# EAGLE design power_supply_board (EAGLE 9.4.2)
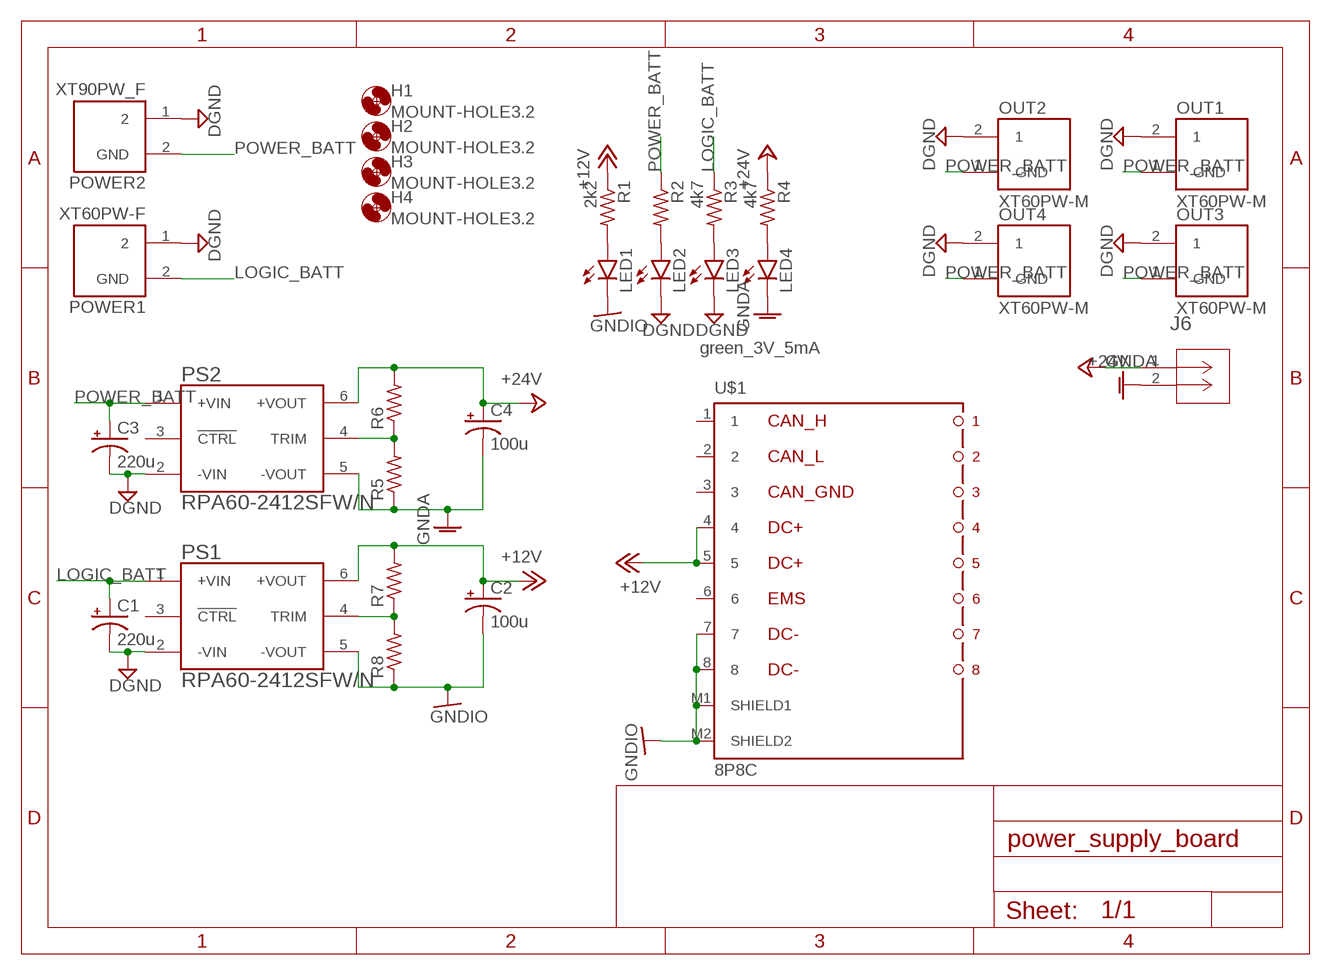
[diagram p0: schematic, sheet 1]

## Parts
C1  220u  CPOL-USE2.5-5  [E2,5-5]
C2  100u  CPOL-USE2-5  [E2-5]
C3  220u  CPOL-USE2.5-5  [E2,5-5]
C4  100u  CPOL-USE2-5  [E2-5]
H1  MOUNT-HOLE3.2  [3,2]
H2  MOUNT-HOLE3.2  [3,2]
H3  MOUNT-HOLE3.2  [3,2]
H4  MOUNT-HOLE3.2  [3,2]
J6  1744426-2  [CONN2_1744426-2]
LED1  LEDSML0603  [SML0603]
LED2  LEDSML0603  [SML0603]
LED3  green_3V_5mA  LEDSML0603  [SML0603]
LED4  LEDSML0603  [SML0603]
OUT1  XT60PW-M  [AMASS_XT60PW_M]
OUT2  XT60PW-M  [AMASS_XT60PW_M]
OUT3  XT60PW-M  [AMASS_XT60PW_M]
OUT4  XT60PW-M  [AMASS_XT60PW_M]
POWER1  XT60PW-F  [AMASS_XT60PW-F]
POWER2  XT90PW_F  [AMASS_XT90PW_F]
PS1  RPA60-2412SFW/N  [CONV_RPA60-2412SFW/N]
PS2  RPA60-2412SFW/N  [CONV_RPA60-2412SFW/N]
R1  2k2  R-US_R0603  [R0603]
R2  R-US_R0603  [R0603]
R3  4k7  R-US_R0603  [R0603]
R4  4k7  R-US_R0603  [R0603]
R5  R-US_R0603  [R0603]
R6  R-US_R0603  [R0603]
R7  R-US_R0603  [R0603]
R8  R-US_R0603  [R0603]
U$1  8P8C  [8P8C]

## Nets
+12V: C2.+ PS1.6(+VOUT) R1.1 R7.2 U$1.4 U$1.5
+24V: C4.+ J6.1 PS2.6(+VOUT) R4.1 R6.2
DGND: C1.- C3.- LED2.C LED3.C OUT1.2 OUT2.2 OUT3.2 OUT4.2 POWER1.1 POWER2.1 PS1.2(-VIN) PS2.2(-VIN)
GNDA: C4.- J6.2 LED4.C PS2.5(-VOUT) R5.1
GNDIO: C2.- LED1.C PS1.5(-VOUT) R8.1 U$1.7 U$1.8 U$1.M1(SHIELD1) U$1.M2(SHIELD2)
LOGIC_BATT: C1.+ POWER1.2(GND) PS1.1(+VIN) R3.1
N$1: LED1.A R1.2
N$2: LED2.A R2.2
N$3: LED3.A R3.2
N$4: LED4.A R4.2
N$5: PS2.4(TRIM) R5.2 R6.1
N$6: PS1.4(TRIM) R7.1 R8.2
POWER_BATT: C3.+ OUT1.1(GND) OUT2.1(GND) OUT3.1(GND) OUT4.1(GND) POWER2.2(GND) PS2.1(+VIN) R2.1
Unconnected: PS1.3(!CTRL) PS2.3(!CTRL) U$1.1 U$1.2 U$1.3 U$1.6

## Library data of the parts
C1-C4 = rcl:CPOL-US: POLARIZED CAPACITOR, American symbol; SPICEPREFIX: C
H1-H4 = holes:MOUNT-HOLE: MOUNTING HOLE with drill center marker
J6 = EP2.5:1744426-2; MANUFACTURER_PART_NUMBER: 17444262; VENDOR: TE Connectivity
LED1-LED4 = led:LED: LED OSRAM: - CHIPLED LG R971, LG N971, LY N971, LG Q971, LY Q971, LO R971, LY R971 LH N974, LH R974 LS Q976, LO Q976, LY Q976 LO Q996 - Hyper CHIPLED LW Q18S LB Q993, LB Q99A, LB R99A - SideLED LS A670, LO A670, LY A670, LG A670, LP A670 LB A673, LV A673, LT A673, LW A673 LH A674 LY A675 LS A676, LA A676, LO A676, LY A676, LW A676 LS A679, LY A679, LG A679 - Hyper Micro SIDELED® LS Y876, LA Y876, LO Y876, LY Y876 LT Y87S - SmartLED LW L88C, LW L88S LB L89C, LB L89S, LG L890 LS L89K, LO L89K, LY L89K LS L896, LA L896, LO L896, LY L896 - TOPLED LS T670, LO T670, LY T670, LG T670, LP T670 LSG T670, LSP T670, LSY T670, LOP T670, LYG T670 LG T671, LOG T671, LSG T671 LB T673, LV T673, LT T673, LW T673 LH T674 LS T676, LA T676, LO T676, LY T676, LB T676, LH T676, LSB T676, LW T676 LB T67C, LV T67C, LT T67C, LS T67K, LO T67K, LY T67K, LW E67C LS E67B, LA E67B, LO E67B, LY E67B, LB E67C, LV E67C, LT E67C LW T67C LS T679, LY T679, LG T679 LS T770, LO T770, LY T770, LG T770, LP T770 LB T773, LV T773, LT T773, LW T773 LH T774 LS E675, LA E675, LY E675, LS T675 LS T776, LA T776, LO T776, LY T776, LB T776 LHGB T686 LT T68C, LB T68C - Hyper Mini TOPLED® LB M676 - Mini TOPLED Santana® LG M470 LS M47K, LO M47K, LY M47K Source: http://www.osram.convergy.de LUXEON: - LUMILED® LXK2-PW12-R00, LXK2-PW12-S00, LXK2-PW14-U00, LXK2-PW14-V00 LXK2-PM12-R00, LXK2-PM12-S00, LXK2-PM14-U00 LXK2-PE12-Q00, LXK2-PE12-R00, LXK2-PE12-S00, LXK2-PE14-T00, LXK2-PE14-U00 LXK2-PB12-K00, LXK2-PB12-L00, LXK2-PB12-M00, LXK2-PB14-N00, LXK2-PB14-P00, LXK2-PB14-Q00 LXK2-PR12-L00, LXK2-PR12-M00, LXK2-PR14-Q00, LXK2-PR14-R00 LXK2-PD12-Q00, LXK2-PD12-R00, LXK2-PD12-S00 LXK2-PH12-R00, LXK2-PH12-S00 LXK2-PL12-P00, LXK2-PL12-Q00, LXK2-PL12-R00 Source: www.luxeon.com KINGBRIGHT: KA-3528ASYC Source: www.kingbright.com
OUT1-OUT4 = XT60_Connecotr:XT60PW-M
POWER1 = XT60_Connecotr:XT60PW-F; AVAILABILITY: Unavailable; MF: AMASS; MP: XT60PW-M; PACKAGE: Package Analog Devices; PRICE: None
POWER2 = XT60_Connecotr:XT90PW_F
PS1 PS2 = RPA60-2412SFW_N:RPA60-2412SFW/N: 60 Watt 2“x1“ Single Output; AVAILABILITY: Unavailable; DESCRIPTION: CONV DC/DC 60W 9-36VIN 12VOUT THT 2x1; MF: Recom Power; MP: RPA60-2412SFW/N; PACKAGE: DIP-6 Recom Power; PRICE: None
R1-R8 = rcl:R-US_: RESISTOR, American symbol; SPICEPREFIX: R
U$1 = con-rj45:8P8C

## Board
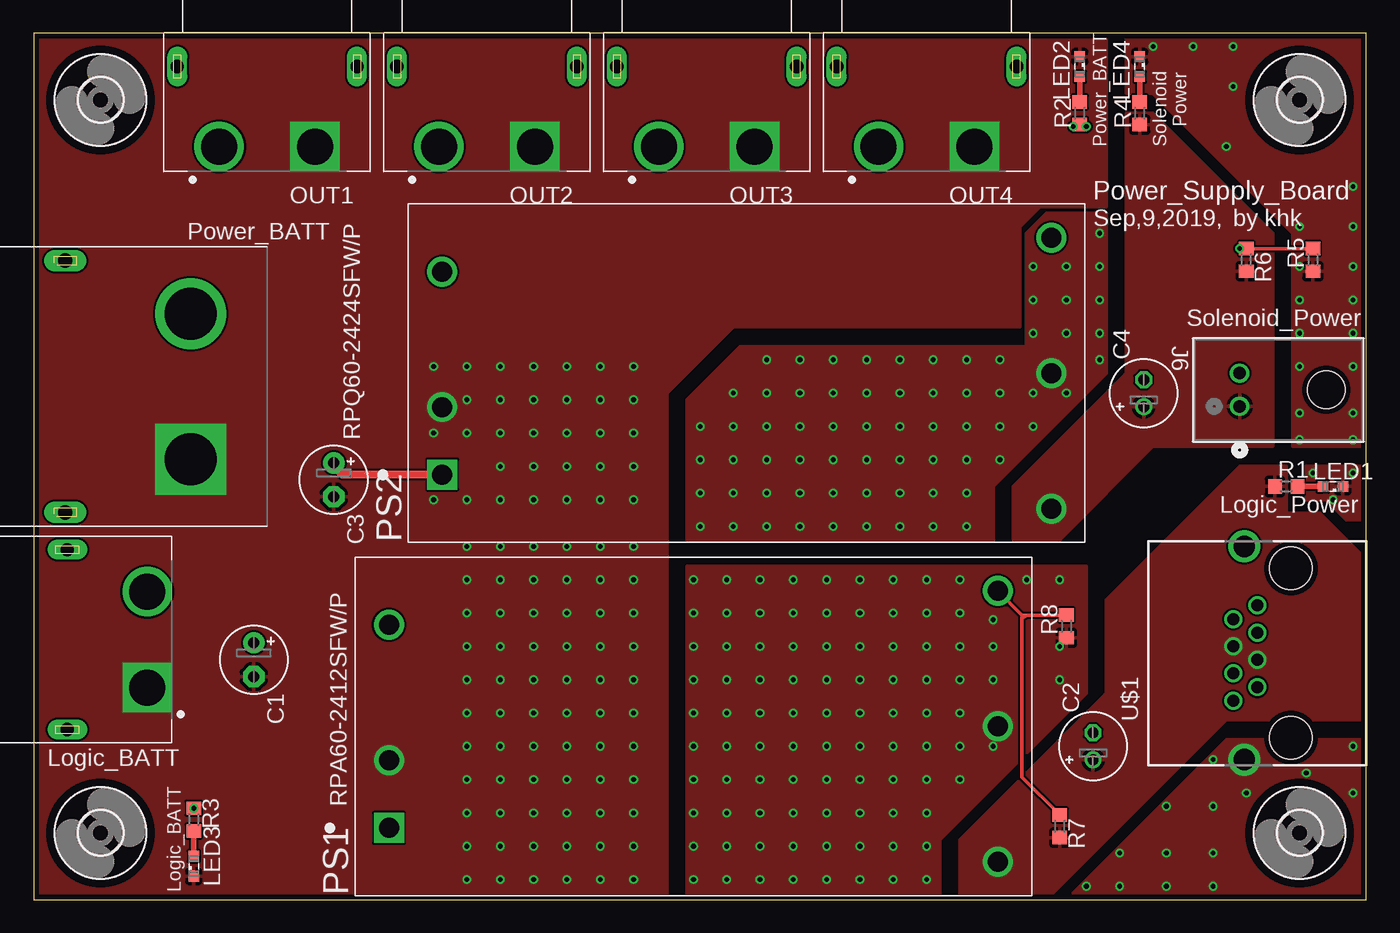
[diagram p1: board, top side]
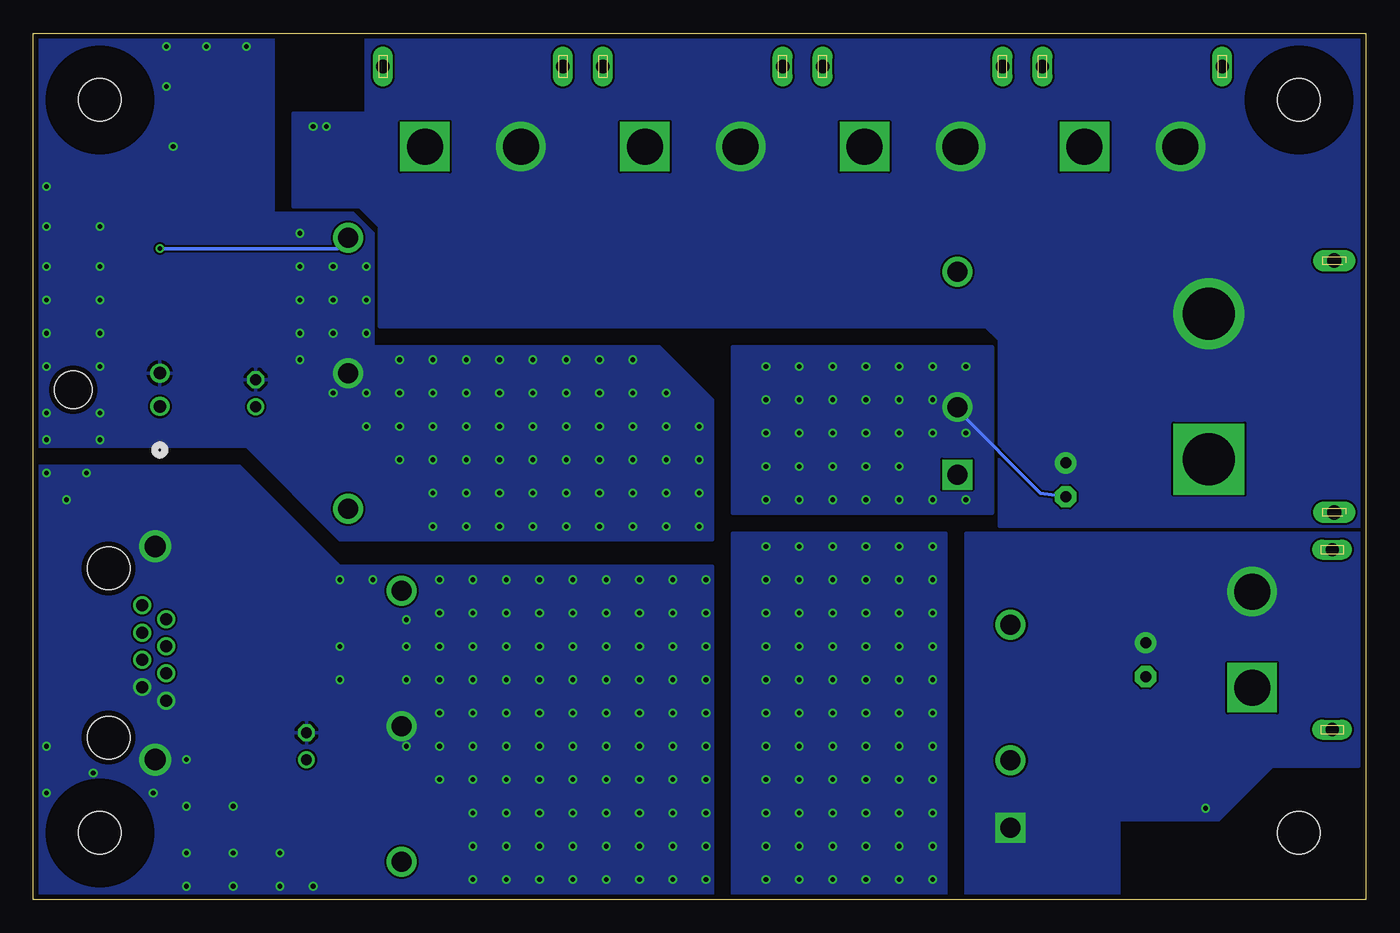
[diagram p2: board, bottom side, seen from below]

Size 100 x 65 mm. Coordinates in mm from the lower left corner, seen from the top.
Outline: 0,0 100,0 100,65 0,65 0,0
Copper layers (1*16): Top 0.035mm / dielectric 1.5mm / Bottom 0.035mm
Design rules "seeed_2layers": minimum track width 6mil, minimum drill 0.2mm, track to track 6mil, track to pad 6mil, pad to pad 6mil, via to via 6mil, smd to smd 0mil, copper to edge 0.4mm, drill to drill 12mil, minimum pad ring 0.15mm, minimum via ring 0.15mm, stop-mask expansion 4mil, vias tented up to drill 50mil, thermal gap 10mil

### Footprints (pad centres in the part's own frame; a part is rotated, then mirrored left to right if it is on the bottom)
E2,5-5 = drill 0.813 pad 1.6: + -1.27,0 | drill 0.813 pad 1.6 octagon: - 1.27,0
E2-5 = drill 0.813 pad 1.27: + -1.016,0 | drill 0.813 pad 1.27 octagon: - 1.016,0
3,2 = hole 3.2: 0,0
CONN2_1744426-2 = drill 0.94 pad 1.448: 1 2.489,0; 2 0,0 | hole 2.794: 1.245,6.502
SML0603 = smd 0.8 x 0.8: A 0.75,0; C -0.75,0
AMASS_XT60PW_M = drill 2.7: 1 -3.6,-6 | drill 2.7 square: 2 3.6,-6 | drill 1 pad 1.2 long: S1 -6.75,0; S2 6.75,0
AMASS_XT60PW-F = drill 2.7 square: 1 -3.6,-6 | drill 2.7: 2 3.6,-6 | drill 1 pad 1.2 long: S1 -6.75,0; S2 6.75,0
AMASS_XT90PW_F = drill 3.9 pad 5.334 square: 1 -5.45,-2.25 | drill 3.9 pad 5.334: 2 5.45,-2.25 | drill 1.067 pad 1.27 long: S1 -9.45,7.15 | drill 1.067 pad 1.2 long: S2 9.45,7.15
CONV_RPA60-2412SFW/N = drill 1.5 square: 1 -22.86,-7.62 | drill 1.5: 2 -22.86,-2.54; 3 -22.86,7.62; 4 22.86,10.16; 5 22.86,0; 6 22.86,-10.16
R0603 = smd 1 x 1.1: 1 -0.85,0; 2 0.85,0
8P8C = drill 0.9 pad 1.3: 1 3.57,-3.81; 2 2.55,-2.03; 3 1.53,-3.81; 4 0.51,-2.03; 5 -0.51,-3.81; 6 -1.53,-2.03; 7 -2.55,-3.81; 8 -3.57,-2.03 | drill 1.6 pad 2.184: M1 -8,-2.85; M2 8,-2.85 | hole 3.2: 6.35,-6.35; -6.35,-6.35

### Placement (x,y rotation side)
C1  16.5,18 270 top
C2  79.5,11.5 90 top
C3  22.5,31.5 270 top
C4  83.3,38 90 top
H1  5,60 0 top
H2  95,60 0 top
H3  5,5 0 top
H4  95,5 0 top
J6  90.5,39.5 270 top
LED1  97.5,31 180 top
LED2  78.5,62.5 270 top
LED3  12,2.5 90 top
LED4  83,62.5 270 top
OUT1  17.5,62.5 0 top
OUT2  34,62.5 0 top
OUT3  50.5,62.5 0 top
OUT4  67,62.5 0 top
POWER1  2.5,19.5 90 top
POWER2  9.5,38.5 90 top
PS1  49.5,13 0 top
PS2  53.5,39.5 0 top
R1  94,31 0 top
R2  78.5,59 90 top
R3  12,6 270 top
R4  83,59 90 top
R5  96,48 90 top
R6  91,48 270 top
R7  77,5.5 270 top
R8  77.5,20.5 90 top
U$1  88,18.5 90 top

### Tracks (layer width: path | path; a pad name or v marks a point on that pad's centre or on a via)
+12V
  pour Top: 69.5,0 76,0 89.5,13.5 100,13.5 100,25.5 96.5,29 94,29 94,32.5 90.5,32.5 80.5,22.5 80.5,15.5 69.5,4.5
+24V
  pour Top: 77,27 84,34 93,34 93,50 84,59 82,59 82,39.5 73.5,31 73.5,27
DGND  (via drill 0.35)
  Bottom 0.254: C3.- 24.39,30.48 30.64,36.74 PS2.2
  other vias: 32.5,26.5 35,26.5 37.5,26.5 40,26.5 42.5,26.5 45,26.5 32.5,24 35,24 37.5,24 40,24 42.5,24 45,24 32.5,21.5 35,21.5 37.5,21.5 40,21.5 42.5,21.5 45,21.5 32.5,19 35,19 37.5,19 40,19 42.5,19 45,19 32.5,16.5 35,16.5 37.5,16.5 40,16.5 42.5,16.5 45,16.5 32.5,14 35,14 37.5,14 40,14 42.5,14 45,14 32.5,11.5 35,11.5 37.5,11.5 40,11.5 42.5,11.5 45,11.5 32.5,9 35,9 37.5,9 40,9 42.5,9 45,9 32.5,6.5 35,6.5 37.5,6.5 40,6.5 42.5,6.5 45,6.5 32.5,4 35,4 37.5,4 40,4 42.5,4 45,4 32.5,1.5 35,1.5 37.5,1.5 40,1.5 42.5,1.5 45,1.5 45,30 42.5,30 40,30 37.5,30 35,30 32.5,30 30,30 30,35 32.5,35 35,35 35,32.5 37.5,35 37.5,32.5 40,32.5 40,35 42.5,35 42.5,32.5 45,32.5 45,35 32.5,37.5 32.5,40 35,40 35,37.5 37.5,37.5 37.5,40 40,40 40,37.5 42.5,37.5 42.5,40 45,40 45,37.5 30,40
  pour Top: 0,0 47.5,0 47.5,38 52.5,43 74,43 74,50.5 75.5,52 80.5,52 80.5,65 0,65
  pour Bottom: 31.5,27.5 47.5,27.5 47.5,0 31.5,0
  pour Bottom: 28,29 28,41.5 47.5,41.5 47.5,29
GNDA  (via drill 0.35)
  other vias: 50,28 52.5,28 55,28 57.5,28 60,28 62.5,28 65,28 67.5,28 70,28 55,40.5 57.5,40.5 60,40.5 62.5,40.5 65,40.5 67.5,40.5 70,40.5 75,38 75,35.5 72.5,35.5 75,42.5 80,42.5 77.5,38 80,45 77.5,42.5 52.5,38 55,38 57.5,38 60,38 62.5,38 65,38 67.5,38 70,38 50,35.5 52.5,35.5 55,35.5 57.5,35.5 60,35.5 62.5,35.5 65,35.5 67.5,35.5 70,35.5 50,33 52.5,33 55,33 57.5,33 60,33 62.5,33 65,33 67.5,33 70,33 50,30.5 52.5,30.5 55,30.5 57.5,30.5 60,30.5 62.5,30.5 65,30.5 67.5,30.5 70,30.5 95,34.5 99,34.5 99,36.5 95,36.5 95,40 99,40 95,42.5 99,42.5 99,45 95,45 95,47.5 99,47.5 99,50.5 95,50.5 99,53.5 89.5,56.5 84,64 87,64 90,64 90,61 72.5,40.5 72.5,38 75,45 77.5,45 77.5,47.5 75,47.5 80,47.5 80,50 80,40.5 72.5,33
  pour Bottom: 82,65 82,51.5 76,51.5 74.5,50 74.5,41.5 53,41.5 49,37.5 49,27 77,27 84,34 100,34 100,65
  pour Top: 74.5,41.5 53,41.5 49,37.5 49,27 72,27 72,31 80.5,39.5 80.5,51.5 76,51.5 74.5,50
  pour Top: 82,65 100,65 100,34 94.5,34 94.5,50 84,60.5 82,60.5
GNDIO  (via drill 0.35)
  other vias: 99,32 96,32 97.5,30 99,11.5 99,8 95.5,9.5 91,8 88.5,10.5 88.5,7 88.5,3.5 88.5,1 85,1 81.5,1 79,1 81.5,3.5 85,7 85,3.5 49.5,1.5 49.5,4 49.5,6.5 49.5,9 49.5,11.5 49.5,14 49.5,16.5 49.5,19 49.5,21.5 49.5,24 52,24 52,21.5 52,19 52,16.5 52,14 52,11.5 52,9 52,6.5 52,4 52,1.5 54.5,1.5 57,1.5 54.5,4 57,4 59.5,4 59.5,1.5 62,1.5 62,4 64.5,4 64.5,1.5 67,1.5 67,4 54.5,6.5 54.5,9 57,6.5 59.5,6.5 57,9 59.5,9 54.5,11.5 54.5,14 57,11.5 59.5,11.5 57,14 59.5,14 54.5,16.5 54.5,19 57,16.5 59.5,16.5 57,19 59.5,19 54.5,21.5 54.5,24 57,21.5 57,24 59.5,21.5 59.5,24 62,6.5 64.5,6.5 67,6.5 62,9 64.5,9 67,9 62,11.5 64.5,11.5 67,11.5 62,14 64.5,14 67,14 62,16.5 64.5,16.5 67,16.5 62,19 64.5,19 67,19 62,21.5 62,24 64.5,21.5 64.5,24 67,21.5 67,24 69.5,9 72,11.5 69.5,11.5 69.5,14 69.5,16.5 72,16.5 77,16.5 69.5,19 72,19 77,19 69.5,21.5 69.5,24 72,21 74.5,24 77,24
  pour Bottom: 49,25 49,0 100,0 100,32.5 84.5,32.5 77,25
  pour Top: 49,25 49,0 68,0 68,4.5 79,15.5 79,22.5 79,25
  pour Top: 77.5,0 100,0 100,12 89.5,12
  pour Top: 95.5,32.5 95.5,30 97,30 98.5,28.5 100,28.5 100,32.5
LOGIC_BATT  (via drill 0.35)
  Bottom 0.152: R3.1 12,7
  other vias: 12,6.85
  pour Bottom (no thermals): 11,6 18.5,6 18.5,0 30,0 30,27.5 0,27.5 0,10.5 0.5,10 7,10
N$1
  Top 0.406: LED1.A R1.2
N$2
  Top 0.406: LED2.A R2.2
N$3
  Top 0.406: LED3.A R3.2
N$4
  Top 0.406: R4.2 LED4.A
N$5  (via drill 0.35)
  Top 0.254: R5.2 R6.1 v90.5,48.85
  Bottom 0.254: PS2.4 77.17,48.85 v90.5,48.85
N$6
  Top 0.254: R8.2 74.5,21.35 | 74.5,21.35 74.17,21.35 | PS1.4 74.17,21.35 | R7.1 74.17,9.18 74.17,21.02 | 74.17,21.02 74.17,21.35 | 74.17,21.02 74.5,21.35
POWER_BATT  (via drill 0.35)
  Top 0.254: v78,58 78.35,58 R2.1 78.85,58.15 v79,58
  Top 0.61: PS2.1 23.14,31.88 C3.+
  pour Bottom (no thermals): 75,65 0,65 0,28 27.5,28 27.5,42 28.5,43 74,43 74,50.5 75.5,52 80.5,52 80.5,59 75,59

### Text on the board
tNames: Power | Power_BATT | Solenoid | Power_Supply_Board | Power_BATT | Sep,9,2019, | by khk | Solenoid_Power | RPQ60-2424SFW/P | Logic_Power | Logic_BATT | Logic_BATT | RPA60-2412SFW/P